# EAGLE design PowerInjeect (EAGLE 6.6.0)
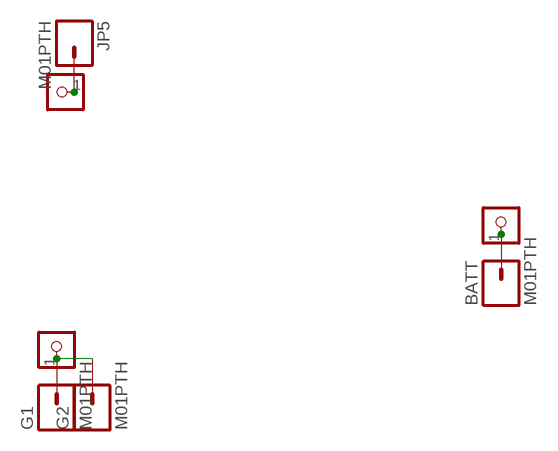
[diagram p0: schematic, sheet 1]

## Parts
BATT  M01PTH  [1X01]
G1  M01PTH  [1X01]
G2  M01PTH  [1X01]
J2  CON_HEADER_1X01-PTH_10_17  [M1X2_10_17]
J3  CON_HEADER_1X01-PTH_10_17  [M1X2_10_17]
J6  CON_HEADER_1X01-PTH_10_17  [M1X2_10_17]
JP5  M01PTH  [1X01]

## Nets
N$1: G1.1 G2.1 J3.1
N$2: J2.1 JP5.1
N$3: BATT.1 J6.1

## Library data of the parts
BATT G1 G2 JP5 = SparkFun-Connectors:M01: Header 1 Standard 1-pin 0.1" header. Use with straight break away headers (SKU : PRT-00116), right angle break away headers (PRT-00553), swiss pins (PRT-00743), machine pins (PRT-00117), and female headers (PRT-00115).
J2 J3 J6 = Dangerous_Prototypes_devices:CON_HEADER_1X01

## Board
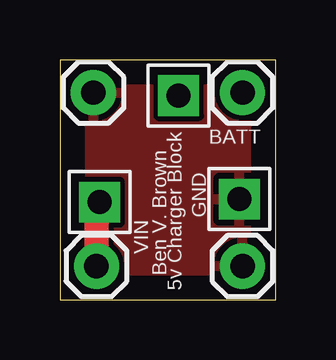
[diagram p1: board, top side]
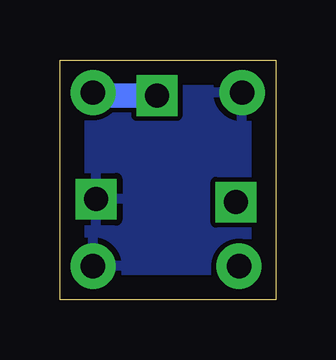
[diagram p2: board, bottom side, seen from below]

Size 9 x 10 mm. Coordinates in mm from the lower left corner, seen from the top.
Outline: 0,0 9,0 9,10 0,10 0,0
Copper layers (1*16): Top 0.035mm / dielectric 1.5mm / Bottom 0.035mm
Design rules "default": minimum track width 10mil, minimum drill 24mil, track to track 8mil, track to pad 8mil, pad to pad 8mil, via to via 8mil, smd to smd 8mil, copper to edge 40mil, drill to drill 8mil, minimum pad ring 10mil, minimum via ring 8mil, stop-mask expansion 4mil, vias tented up to drill 0mil, thermal gap 10mil

### Footprints (pad centres in the part's own frame; a part is rotated, then mirrored left to right if it is on the bottom)
1X01 = drill 1.016 pad 1.88: 1 0,0
M1X2_10_17 = drill 1 pad 1.7 square: 1 0,0

### Placement (x,y rotation side)
BATT  7.62,8.64 0 top
G1  7.62,1.4 0 top
G2  1.4,8.64 0 top
J2  1.65,4.06 0 top
J3  7.49,4.19 0 top
J6  4.95,8.51 0 top
JP5  1.52,1.4 0 top

### Tracks (layer width: path | path; a pad name or v marks a point on that pad's centre or on a via)
N$1
  pour Top: -1.27,10.79 10.16,10.79 10.16,-1.27 -1.27,-1.27
  pour Bottom: -0.64,10.16 9.53,10.16 9.53,-0.64 -0.64,-0.64
N$2
  Top 1.016: J2.1 1.52,4.06 JP5.1
N$3
  Bottom 1.016: J6.1 7.62,8.51 BATT.1

### Text on the board
tPlace: BATT | GND | VIN | Ben V. Brown | 5v Charger Block